# Altium schematic sheet STM32WL_BGA73_RefBoard_IPD_LP.SchDoc: STM32WL BGA73 REF BOARD IPD_LP
size A3; Author: D.Hubaut; Organization: STMicroelectronics; Address2: 12 Rue Jules Horowitz; Address3: 38019 Grenoble; Address4: France; DocumentNumber: MB1849; Revision: B; SheetNumber: 2; SheetTotal: 2
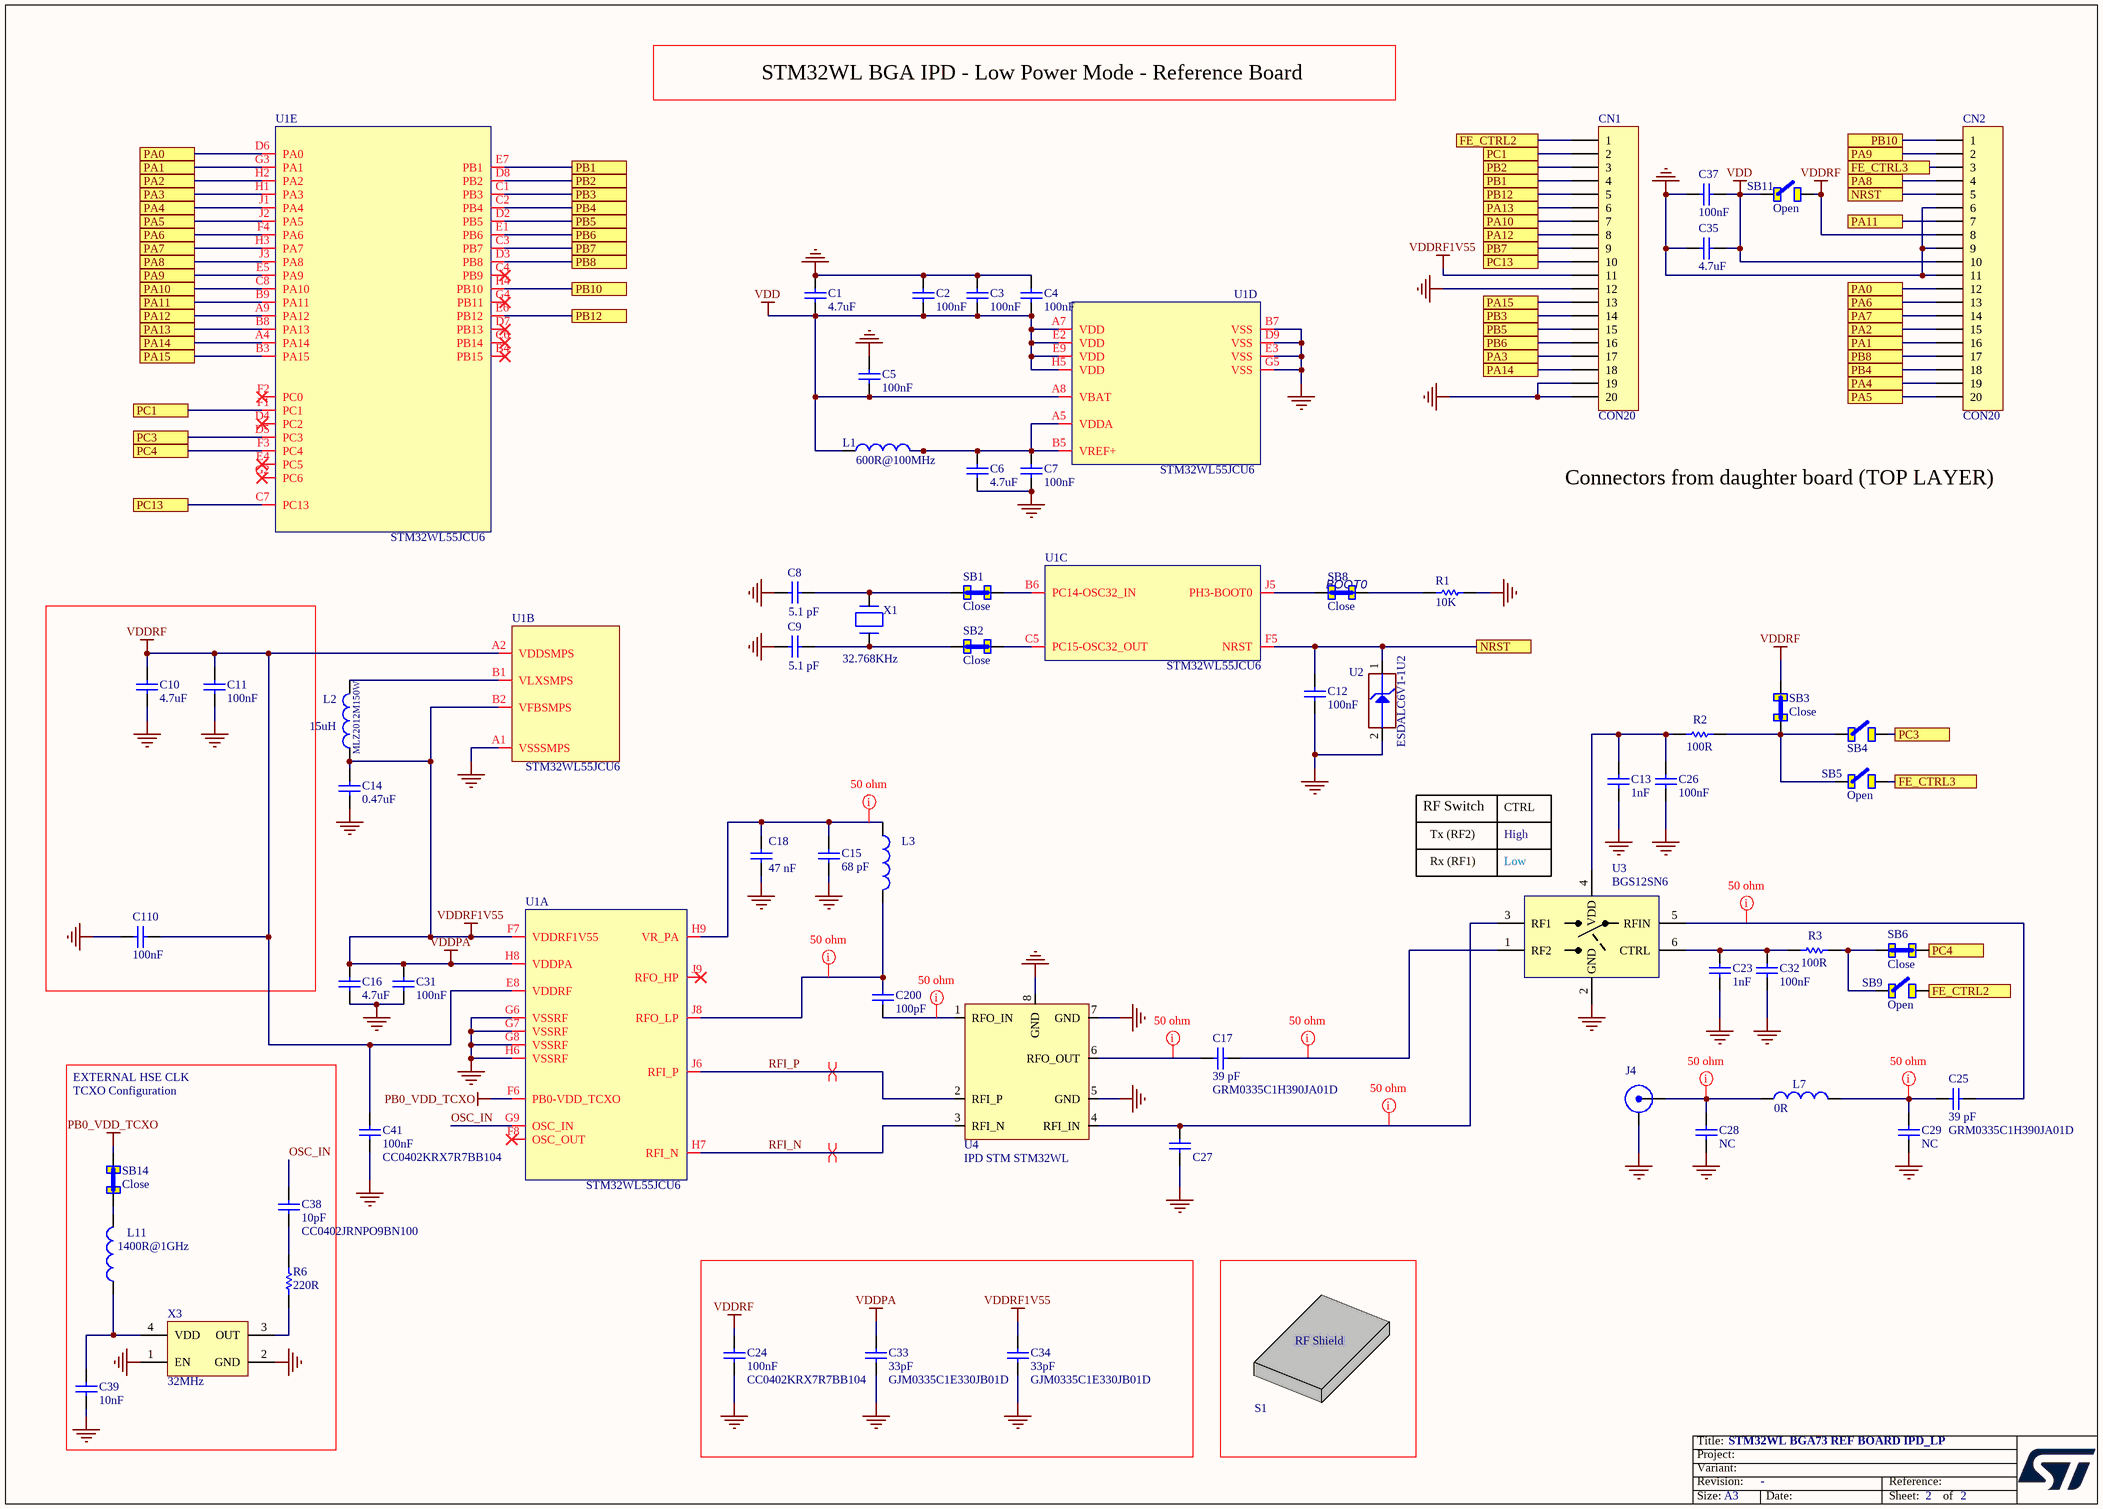
[diagram p0: STM32WL_BGA73_RefBoard_IPD_LP.SchDoc]

## Parts
C1  value 4.7uF  [CAPC1608X09N]
C2  value 100nF  [CAPC1005X06N]
C3  value 100nF  [CAPC1005X06N]
C4  value 100nF  [CAPC1005X06N]
C5  value 100nF  [CAPC1005X06N]
C6  value 4.7uF  [CAPC1608X09N]
C7  value 100nF  [CAPC1005X06N]
C8  value 5.1 pF  [CAPC1005X06N]  (hidden comment: Capacitor)
C9  value 5.1 pF  [CAPC1005X06N]  (hidden comment: Capacitor)
C10  value 4.7uF  [CAPC1608X09N]
C11  value 100nF  [CAPC1005X06N]
C12  value 100nF  [CAPC1005X06N]
C13  value 1nF  [0201]  (hidden comment: MCD-00198)
C14  value 0.47uF  [CAPC1608X09N]
C15  value 68 pF  [CAPC1005X06N]
C16  value 4.7uF  [CAPC1608X09N]
C17  value 39 pF  Manufacturer_Part_Number: GRM0335C1H390JA01D  [rlc_201_smd]  (hidden comment: RFCapacitor_201)
C18  value 47 nF  [CAPC1005X06N]
C23  value 1nF  [0201]  (hidden comment: MCD-00198)
C24  value 100nF  Manufacturer_Part_Number: CC0402KRX7R7BB104  [CAPC1005X06N]
C25  value 39 pF  Manufacturer_Part_Number: GRM0335C1H390JA01D  [rlc_201_smd]  (hidden comment: RFCapacitor_201)
C26  value 100nF  [0201]  (hidden comment: MCD-00102)
C27  NC  [rlc_201_smd]  (value not drawn)
C28  value NC  [rlc_201_smd]  (hidden comment: RFCapacitor_201)
C29  value NC  [rlc_201_smd]  (hidden comment: RFCapacitor_201)
C31  value 100nF  [CAPC1005X06N]
C32  value 100nF  [0201]  (hidden comment: MCD-00102)
C33  value 33pF  Manufacturer_Part_Number: GJM0335C1E330JB01D  [0201]
C34  value 33pF  Manufacturer_Part_Number: GJM0335C1E330JB01D  [0201]
C35  value 4.7uF  [CAPC1608X09N]
C37  value 100nF  [CAPC1005X06N]
C38  value 10pF  Manufacturer_Part_Number: CC0402JRNPO9BN100  [C0402]  (hidden comment: Capacitor)
C39  value 10nF  [C0402]
C41  value 100nF  Manufacturer_Part_Number: CC0402KRX7R7BB104  [CAPC1005X06N]
C110  value 100nF  [CAPC1005X06N]
C200  value 100pF  [0201]  (hidden comment: MCD-00198)
CN1  CON20  [CO_SAMTEC_TSW-120-07-x-S]
CN2  CON20  [CO_SAMTEC_TSW-120-07-x-S]
J4  Amphenol_132430  [SMA_AMPHENOL_50ohms_Edge_PCB]  (value not drawn)
L1  value 600R@100MHz  [INDC1608X95N]
L2  value 15uH  Manufacturer_Part_Number: MLZ2012M150W  [INDC2012X13N]
L3  (no value)  [IND_MURATA_LQW15A]
L7  value 0R  [rlc_201_smd]  (hidden comment: Ferrite)
L11  value 1400R@1GHz  [IND_0402_MURATA_BLM15H_H0P5]
R1  value 10K  [RESC1608X05N]
R2  value 100R  [0201]  (hidden comment: MCD-00119)
R3  value 100R  [0201]  (hidden comment: MCD-00119)
R6  value 220R  [R0402]  (hidden comment: Resistor)
S1  RF-Shield  (value not drawn)
SB1  Close  [SB_0402]
SB2  Close  [SB_0402]
SB3  Close  [0201]
SB4  Open  [0201]  (value not drawn)
SB5  Open  [0201]
SB6  Close  [0201]
SB8  Close  [SB_0402]
SB9  Open  [0201]
SB11  Open  [SB_0402]
SB14  Close  [SB_0402]
U1  Manufacturer_Part_Number: STM32WL55JCU6  [BGA73C50P9X9_500X500X60]  (parts A,B,C,D,E of 5)
U2  Manufacturer_Part_Number: ESDALC6V1-1U2  [DIOM0603X03N]
U3  BGS12SN6  [TSNP-6-2]
U4  IPD STM STM32WL  [IPD STM]
X1  value 32.768KHz  [OSC_NDK_NX2012SA]  (hidden comment: XTAL_2_PINS)
X3  value 32MHz  [CRY_NDK_NT2016SB_4P]

## Ports
FE_CTRL2, FE_CTRL3, NRST, PA0, PA1, PA2, PA3, PA4, PA5, PA6, PA7, PA8, PA9, PA10, PA11, PA12, PA13, PA14, PA15, PB1, PB2, PB3, PB4, PB5, PB6, PB7, PB8, PB10, PB12, PC1, PC3, PC4, PC13

## Nets
GND: C1.1 C2.1 C3.1 C4.1 C5.1 C6.2 C7.2 C8.2 C9.2 C10.2 C11.2 C12.2 C13.2 C14.2 C15.1 C16.2 C18.2 C23.1 C24.2 C26.2 C27.1 C28.2 C29.2 C31.2 C32.2 C33.1 C34.1 C35.2 C37.2 C39.1 C41.2 C110.2 CN1.12 CN1.19 CN1.20 CN2.6 CN2.9 CN2.11 J4.2(Y) R1.1 U1.A1(VSSSMPS) U1.B7(VSS) U1.D9(VSS) U1.E3(VSS) U1.G5(VSS) U1.G6(VSSRF) U1.G7(VSSRF) U1.G8(VSSRF) U1.H6(VSSRF) U2.2(GND) U3.2(GND) U4.5(GND) U4.7(GND) U4.8(GND) X3.1(EN) X3.2(GND)
PB0_VDD_TCXO: SB14.2 U1.F6(PB0-VDD_TCXO)
VDD: C1.2 C2.2 C3.2 C4.2 C5.2 C35.1 C37.1 CN2.10 L1.1 SB11.2 U1.A7(VDD) U1.A8(VBAT) U1.E2(VDD) U1.E9(VDD) U1.H5(VDD)
VDDPA: C14.1 C16.1 C31.1 C33.2 C34.2 CN1.11 L2.1 U1.B2(VFBSMPS) U1.F7(VDDRF1V55) U1.H8(VDDPA)  [also labelled VDDRF1V55]
VDDRF: C10.1 C11.1 C24.1 C41.1 C110.1 CN2.8 SB3.1 SB11.1 U1.A2(VDDSMPS) U1.E8(VDDRF)
FE_CTRL2: CN1.1 SB9.1 ; port FE_CTRL2
FE_CTRL3: CN2.3 SB5.1 ; port FE_CTRL3
NRST: C12.1 CN2.5 U1.F5(NRST) U2.1(IO1) ; port NRST
OSC_IN: C38.2 U1.G9(OSC_IN)
PA0: CN2.12 U1.D6(PA0) ; port PA0
PA1: CN2.16 U1.G3(PA1) ; port PA1
PA2: CN2.15 U1.H2(PA2) ; port PA2
PA3: CN1.17 U1.H1(PA3) ; port PA3
PA4: CN2.19 U1.J1(PA4) ; port PA4
PA5: CN2.20 U1.J2(PA5) ; port PA5
PA6: CN2.13 U1.F4(PA6) ; port PA6
PA7: CN2.14 U1.H3(PA7) ; port PA7
PA8: CN2.4 U1.J3(PA8) ; port PA8
PA9: CN2.2 U1.E5(PA9) ; port PA9
PA10: CN1.7 U1.C8(PA10) ; port PA10
PA11: CN2.7 U1.B9(PA11) ; port PA11
PA12: CN1.8 U1.A9(PA12) ; port PA12
PA13: CN1.6 U1.B8(PA13) ; port PA13
PA14: CN1.18 U1.A4(PA14) ; port PA14
PA15: CN1.13 U1.B3(PA15) ; port PA15
PB1: CN1.4 U1.E7(PB1) ; port PB1
PB2: CN1.3 U1.D8(PB2) ; port PB2
PB3: CN1.14 U1.C1(PB3) ; port PB3
PB4: CN2.18 U1.C2(PB4) ; port PB4
PB5: CN1.15 U1.D2(PB5) ; port PB5
PB6: CN1.16 U1.E1(PB6) ; port PB6
PB7: CN1.9 U1.C3(PB7) ; port PB7
PB8: CN2.17 U1.D3(PB8) ; port PB8
PB10: CN2.1 U1.H4(PB10) ; port PB10
PB12: CN1.5 U1.E6(PB12) ; port PB12
PC1: CN1.2 U1.F1(PC1) ; port PC1
PC3: SB4.1 U1.D5(PC3) ; port PC3
PC4: SB6.1 U1.F3(PC4) ; port PC4
PC13: CN1.10 U1.C7(PC13) ; port PC13
RFI_N: U1.H7(RFI_N) U4.3(RFI_N)
RFI_P: U1.J6(RFI_P) U4.2(RFI_P)
NetC6_1: C6.1 C7.1 L1.2 U1.A5(VDDA) U1.B5(VREF+)
NetC8_1: C8.1 SB1.2 X1.2(X2)
NetC9_1: C9.1 SB2.2 X1.1(X1)
NetC13_1: C13.1 C26.1 R2.1 U3.4(VDD)
NetC15_2: C15.2 C18.1 L3.2 U1.H9(VR_PA)
NetC17_1: C17.1 U3.1(RF2)
NetC17_2: C17.2 U4.6(RFO_OUT)
NetC23_2: C23.2 C32.1 R3.1 U3.6(CTRL)
NetC25_1: C25.1 U3.5(RFIN)
NetC25_2: C25.2 C29.1 L7.1
NetC27_2: C27.2 U3.3(RF1) U4.4(RFI_IN)
NetC28_1: C28.1 J4.1(X) L7.2
NetC38_1: C38.1 R6.2
NetC39_2: C39.2 L11.1 X3.4(VDD)
NetC200_1: C200.1 U4.1(RFO_IN)
NetC200_2: C200.2 L3.1 U1.J8(RFO_LP)
NetL2_2: L2.2 U1.B1(VLXSMPS)
NetL11_2: L11.2 SB14.1
NetR1_2: R1.2 SB8.1
NetR2_2: R2.2 SB3.2 SB4.2 SB5.2
NetR3_2: R3.2 SB6.2 SB9.2
NetR6_1: R6.1 X3.3(OUT)
NetSB1_1: SB1.1 U1.B6(PC14-OSC32_IN)
NetSB2_1: SB2.1 U1.C5(PC15-OSC32_OUT)
NetSB8_2: SB8.2 U1.J5(PH3-BOOT0)

Not connected (* = marked no-connect by the designer): U1 B4(PB15)* C4(PB9)* C6(PB14)* D4(PC2)* D7(PB13)* E4(PC5)* F2(PC0)* F8(OSC_OUT)* G2(PC6)* G4(PB11)* J9(RFO_HP)*

## Layout directives
differential pair; differential pair class RFI: RFI_N, RFI_P
net class 50ohm: NetC15_2, NetC17_1, NetC17_2, NetC25_1, NetC25_2, NetC27_2, NetC28_1, NetC200_1, NetC200_2

## Notes on the sheet
- STM32WL BGA IPD - Low Power Mode - Reference Board
- Connectors from daughter board (TOP LAYER)
- (near SB8) BOOT0
- RF Switch
- Tx (RF2)
- CTRL
- High
- (near U3) Rx (RF1)
- (near U3) Low
- TCXO Configuration
- EXTERNAL HSE CLK
- Title:
- Project:
- Size:
- Revision:
- Variant:
- A3
- -
- Date:
- Reference:
- Sheet:
- of
- (in symbol RF-Shield) RF Shield

## Library data of the parts
C1 C6 C10 C16 C35 = MCD-00009: Capacitor, MLCC, 4.7uF, 16V, X5R, 10%, 0603, T=0.8mm; Manufacturer_Part_Number: CC0603KRX5R7BB475; Manufacturer: YAGEO; Package: C0603
C2-C5 C7 C11 C12 C26 C31 C32 C37 C110 = MCD-00102: Capacitor, MLCC, 100nF, 16V, X7R, 10%, 0402, T=0,5mm; Manufacturer_Part_Number: CC0402KRX7R7BB104; Manufacturer: YAGEO; Package: C0402
C8 C9 = MCD-00003: Capacitor, MLCC, 5.1 pF, 50V, NPO, +-0.1pF, 0402, T=0.5mm; Manufacturer_Part_Number: CC0402CRNPO9BN5R1; Manufacturer: YAGEO
C13 C23 = MCD-00198: Multilayer ceramic capacitors X7R ±10%, 50V; Manufacturer_Part_Number: GRM033R71H102KA12D; Manufacturer: MURATA
C14 = MCD-00009: Multilayer Ceramic Capacitors MLCC - SMD/SMT 16V 0.47uF X5R 0603 10%; Manufacturer_Part_Number: CC0603KRX5R7BB474; Manufacturer: YAGEO; Package: C0603
C15 = MCD-01123: Capacitor, MLCC,68pF, 50V, C0G, 1%, 0402, T=0.5mm; Manufacturer_Part_Number: GRM1555C1E680JA01; Manufacturer: MURATA
C17 = RFCapacitor_201: Multilayer ceramic capacitors COG ±5%, 50V; Manufacturer: GRM0335C1H390JA01D
C18 = MCD-01123: Capacitor, MLCC,47nF, 16V, X7R, 10%, 0402, T=0.5mm; Manufacturer_Part_Number: GRM155C71H473KE19; Manufacturer: MURATA
C24 C41 = MCD-00102: Capacitor, MLCC, 100nF, 16V, X7R, 10%, 0402, T=0,5mm; Manufacturer: YAGEO; Package: C0402
C25 = RFCapacitor_201: Multilayer ceramic capacitors COG ±5%, 50V; Manufacturer: MURATA
C27-C29 = RFCapacitor_201: RF Capacitor High-Q, 0201
  C27: Value: NC
C33 C34 = MCD-00277: Multilayer Ceramic Capacitors MLCC - SMD/SMT 0201 33pF 25volts C0G 5%; Manufacturer: MURATA
C38 = MCD-00015: Capacitor, MLCC, 10pF, 50V, NPO, +/-5%, 0402, T=0,5mm; Part_Preference: Recommended; Manufacturer: YAGEO; Internal_Part_Number: MCD-00015; Status: Released; Part_Type: Capacitor; Package: C0402; ComponentLink1Description: Datasheet; ComponentLink1URL: http://tunmcdsvn.tun.st.com/Component_Datasheet_Library/Trunk/Capacitors/Yageo_Capacitor_NP0_16V-to-50V
C39 = MCD-00011: Capacitor, MLCC, 10nF, 16V, X7R, 10%, 0402, T=0.5mm; Manufacturer_Part_Number: CC0402KRX7R7BB103; Manufacturer: YAGEO; Provided_By: SUBCO; ECCN_US: EAR99; ECCN_EU: NEC; Internal_Part_Number: MCD-00011; Status: Released; Part_Type: Capacitor; Package: C0402; ComponentLink1Description: Datasheet; ComponentLink1URL: http://tunmcdsvn.tun.st.com/Component_Datasheet_Library/Trunk/Capacitors/Yageo_Multilayer_Capacitor_X7R_series_100pF_to_22uF
C200 = MCD-00198: Multilayer ceramic capacitors COG +/-5%, 50V; Manufacturer_Part_Number: GRM033R71H102KA12D; Manufacturer: MURATA
CN1 CN2 = CON20: Connector right-angle, pitch 2.54mm, 20 contacts; Manufacturer: SAMTEC; Manufacturer_Part_Number: TSW-120-07-L-S
J4 = SMA_thickness_1.19mm_AMPHENOL: RF Connector, SMA End Launch Jack for 0.047 inch PCB, 50 Ohm, Flat Tab Contact; Manufacturer_Part_Number: 132430; Manufacturer: AMPHENOL
L1 = MCD-00047: Ferrite Beads 0603 600 OHM; Manufacturer_Part_Number: BLM18AG601SN1D; Manufacturer: MURATA
L2 = MCD-01433: MLZ2012 Multilayer Shielded Inductor 15µH, ±5%; Manufacturer: TDK
L3 = MCD-01330: RF Inductor; Manufacturer: MURATA
L7 = RFInductor_201: Thick Film Resistor ±5%, 1/20W; Manufacturer_Part_Number: CRCW02010000Z0ED; Manufacturer: Vishay/Dale; Status: Footprint available; Part_Type: Inductor; Package: L0201; ComponentLink1Description: Datasheet
L11 = MCD-01610: ferrite bead, 1400ohms at 1GHz, 250mA, 1.1ohms DC max; Manufacturer_Part_Number: BLM15HG102SN1#; Manufacturer: MURATA; Provided_By: SUBCO; Internal_Part_Number: MCD-01610; Status: Footprint available; Part_Type: Inductor; Package: L0402; ComponentLink1Description: Datasheet; ComponentLink1URL: http://tunmcdsvn.tun.st.com/Component_Datasheet_Library/Trunk/Inductors/Murata_ferrite-bead_BLM15series; ECCN_US: n/a; ECCN_EU: n/a
R1 = MCD-00220: Resistor,10K,0603,1%,1/10W; Manufacturer_Part_Number: RC0603FR-0710KL; Manufacturer: YAGEO
R2 R3 = MCD-00119: Thick Film Resistors - SMD 1/20watt 100ohms 5% 200ppm; Manufacturer_Part_Number: CRCW0201100RJNED; Manufacturer: Vishay / Dale
R6 = MCD-00427: Resistor,220R,0402,1%,1/16W; Manufacturer_Part_Number: RC0402FR-07220RL; Manufacturer: YAGEO; ECCN_US: EAR99; ECCN_EU: NEC; Provided_By: SUBCO; Internal_Part_Number: MCD-00427; Status: Released; Part_Type: Resistor; Package: R0402; ComponentLink1Description: Datasheet; ComponentLink1URL: http://tunmcdsvn.tun.st.com/Component_Datasheet_Library/Trunk/Resistors/Yageo_Resistor_RC0402-series
S1 = RF-Shield: RF Shield Frame + Cover without apertures; Manufacturer: Masach Tech; Manufacturer_Part_Number: MS409-10
SB1 SB2 SB8 = SB_0Ohm: Solder Bridge 0R [0402] (Populated with 0 Ohm); Manufacturer: Vishay / Dale; Manufacturer_Part_Number: RCS04020000Z0ED; Revision: July-2002: Re-released for DXP Platform.
SB3 SB6 = SB_0Ohm: Thick Film Resistors - SMD 1/20watt ZEROohm Jumper; Manufacturer: Vishay / Dale; Manufacturer_Part_Number: CRCW02010000Z0ED; VALUE: 0; Revision: July-2002: Re-released for DXP Platform.
SB4 SB5 SB9 = SB_Open: Solder Bridge Open [0402] (Unpopulated); Manufacturer: NOT FITTED; Revision: July-2002: Re-released for DXP Platform.; Manufacturer_Part_Number: NOT FITTED
SB11 = SB_Open: Solder Bridge Open [0402] (Unpopulated); Revision: July-2002: Re-released for DXP Platform.
SB14 = SB_0Ohm: Solder Bridge 0R [0402] (Populated with 0 Ohm); Manufacturer: Vishay / Dale; Manufacturer_Part_Number: RCS04020000Z0ED; VALUE: 0; Revision: July-2002: Re-released for DXP Platform.
U1 = MCD-01435: Multiprotocol Wireless 32-bit MCUwith LPWAN Sub-GHz radio solution; Manufacturer: STMICROELECTRONICS
U2 = MCD-00170: ESD protection 6V1; Manufacturer: STMICROELECTRONICS
U3 = BGS12SN6: DC switch - Ultra-Low  SPDT analog switch; Manufacturer: INFINEON; Manufacturer_Part_Number: BGS12SN6
U4 = IPD ST STM32WL: Manufacturer: STMICROELECTRONICS; Manufacturer_Part_Number: IPD STM STM32WL
X1 = MCD-01479: Crystal 32.768kHz, 6pF, -+20PPM, R=80K, SMD; Manufacturer_Part_Number: NX2012SA 32.768KHz EXS00A-MU00527; Manufacturer: NDK
X3 = MCD-01492: NT2016SA-32M-END4263A; Part_Type: Crystal_Osc; Manufacturer: NDK; Provided_By: SUBCO; ECCN_US: EAR99; ECCN_EU: NEC; Internal_Part_Number: MCD-01492; Status: Checked; Manufacturer_Part_Number: NT2016SA-32M-END4263A; Package: 2016 size; ComponentLink1Description: Datasheet; ComponentLink1URL: http://tunmcdsvn.tun.st.com/Component_Datasheet_Library/Trunk/Crystal_Osc/NDK_NT2016SA